# Altium schematic sheet Buck-Boost 5-12V.SchDoc
size 420 x 297 mm; SheetNumber: 4; SheetTotal: 14
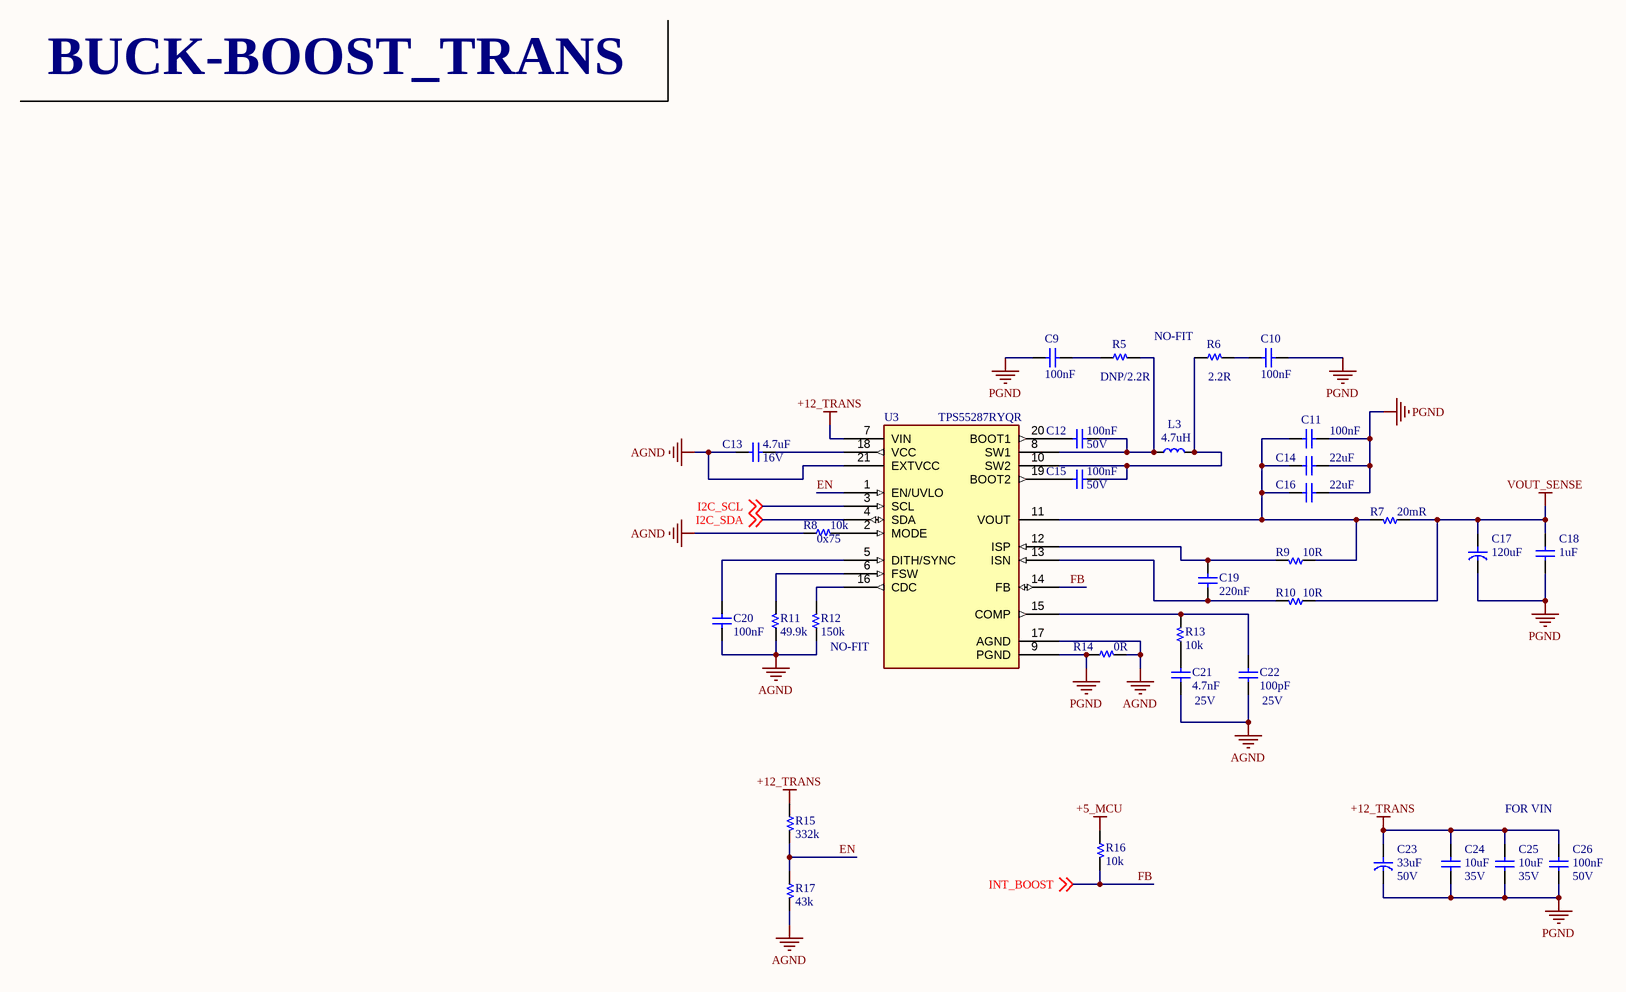
[diagram p0: Buck-Boost 5-12V.SchDoc]

## Parts
C9  100nF  [C 0805]
C10  100nF  [C 0805]
C11  100nF  [C 0402]
C12  100nF  [C 0603]
C13  4.7uF  [C 0402]
C14  22uF  [C 0603]
C15  100nF  [C 0603]
C16  22uF  [C 0603]
C17  120uF  [C SMD TAN 2917 (E)]
C18  1uF  [C 0603]
C19  220nF  [C 0402]
C20  100nF  [C 0402]
C21  4.7nF  [C 0402]
C22  100pF  [C 0402]
C23  33uF  [C SMD TAN 2917 (E)]
C24  10uF  [C 0603]
C25  10uF  [C 0603]
C26  100nF  [C 0402]
L3  4.7uH  [Inductor SMD 6x5.7x4.8]
R5  DNP/2.2R  [R 1206]
R6  2.2R  [R 1206]
R7  20mR  [R 1206]
R8  10k  [R 0402]
R9  10R  [R 0402]
R10  10R  [R 0402]
R11  49.9k  [R 0402]
R12  150k  [R 0402]
R13  10k  [R 0402]
R14  0R  [R 2512]
R15  332k  [R 0402]
R16  10k  [R 0402]
R17  43k  [R 0402]
U3  TPS55287RYQR  [VQFN-HR-21]

## Nets
+5_MCU: R16.1
+12_TRANS: C23.1 C24.1 C25.1 C26.1 R15.1 U3.7(VIN)
AGND: C13.2 C20.2 C21.2 C22.2 R8.1 R11.1 R12.1 R14.2 R17.2 U3.17(AGND) U3.21(EXTVCC)
PGND: C9.1 C10.1 C11.2 C14.2 C16.2 C17.2 C18.2 C23.2 C24.2 C25.2 C26.2 R14.1 U3.9(PGND)
VOUT_SENSE: C17.1 C18.1 R7.1 R10.1
EN: R15.2 R17.1 U3.1(EN/UVLO)
FB: R16.2 U3.14(FB) ; off-sheet INT_BOOST  [also labelled INT_BOOST]
I2C_SCL: U3.3(SCL) ; off-sheet I2C_SCL
I2C_SDA: U3.4(SDA) ; off-sheet I2C_SDA
NetC9_2: C9.2 R5.1
NetC10_2: C10.2 R6.1
NetC11_1: C11.1 C14.1 C16.1 R7.2 R9.1 U3.11(VOUT)
NetC12_1: C12.1 U3.20(BOOT1)
NetC12_2: C12.2 L3.1 R5.2 U3.8(SW1)
NetC13_1: C13.1 U3.18(VCC)
NetC15_1: C15.1 U3.19(BOOT2)
NetC15_2: C15.2 L3.2 R6.2 U3.10(SW2)
NetC19_1: C19.1 R10.2 U3.13(ISN)
NetC19_2: C19.2 R9.2 U3.12(ISP)
NetC20_1: C20.1 U3.5(DITH/SYNC)
NetC21_1: C21.1 R13.1
NetC22_1: C22.1 R13.2 U3.15(COMP)
NetR8_2: R8.2 U3.2(MODE)
NetR11_2: R11.2 U3.6(FSW)
NetR12_2: R12.2 U3.16(CDC)

## Notes on the sheet
- BUCK-BOOST_TRANS
- NO-FIT
- (near C12) 50V
- (near C13) 16V
- (near C15) 50V
- (near R8) 0x75
- (near C21) 25V
- (near C22) 25V
- FOR VIN
- (near C23) 50V
- 35V
- (near C26) 50V
- Project:
- DAL_PDU
- Sub-system:
- IGRVT-50
- Design by:
- KIEN HOANG
- BAO BUI
- Sheet title:
- Sheet
- A3
- of
- Checked by:
- Approved by:
- VU PHAM
- Revision:
- Document No:
- Size:
- Date:

## Library data of the parts
C9 C11 C12 C15 C20 C26 = Capacitor NP: CAP CER 0.1UF 50V X7R 0603
C10 C19 C21 C22 = Capacitor NP: Capacitor non-pol
C13 = Capacitor NP: CAP CER 4.7UF 25V X6S 0603
C14 C16 C18 = Capacitor NP: CAP CER 22UF 35V X5R 1206
C17 = Capacitor: T543X107M025AHE060
C23 = Capacitor: T543X336M050AHE0407505
C24 C25 = Capacitor NP: CAP CER 10UF 35V X5R 0603
L3 = Inductor: EXLA1V0505-4R7-R
R5-R7 R9-R12 R14 = Resistor
R8 R13 R15-R17 = Resistor: RES 10K OHM 1% 1/10W 0603
U3 = TPS55289-Q1